# EAGLE design CC3000 (EAGLE 7.1.0)
COMPANY: ADAFRUIT INDUSTRIES; DRAWN: KTOWN; REV: C
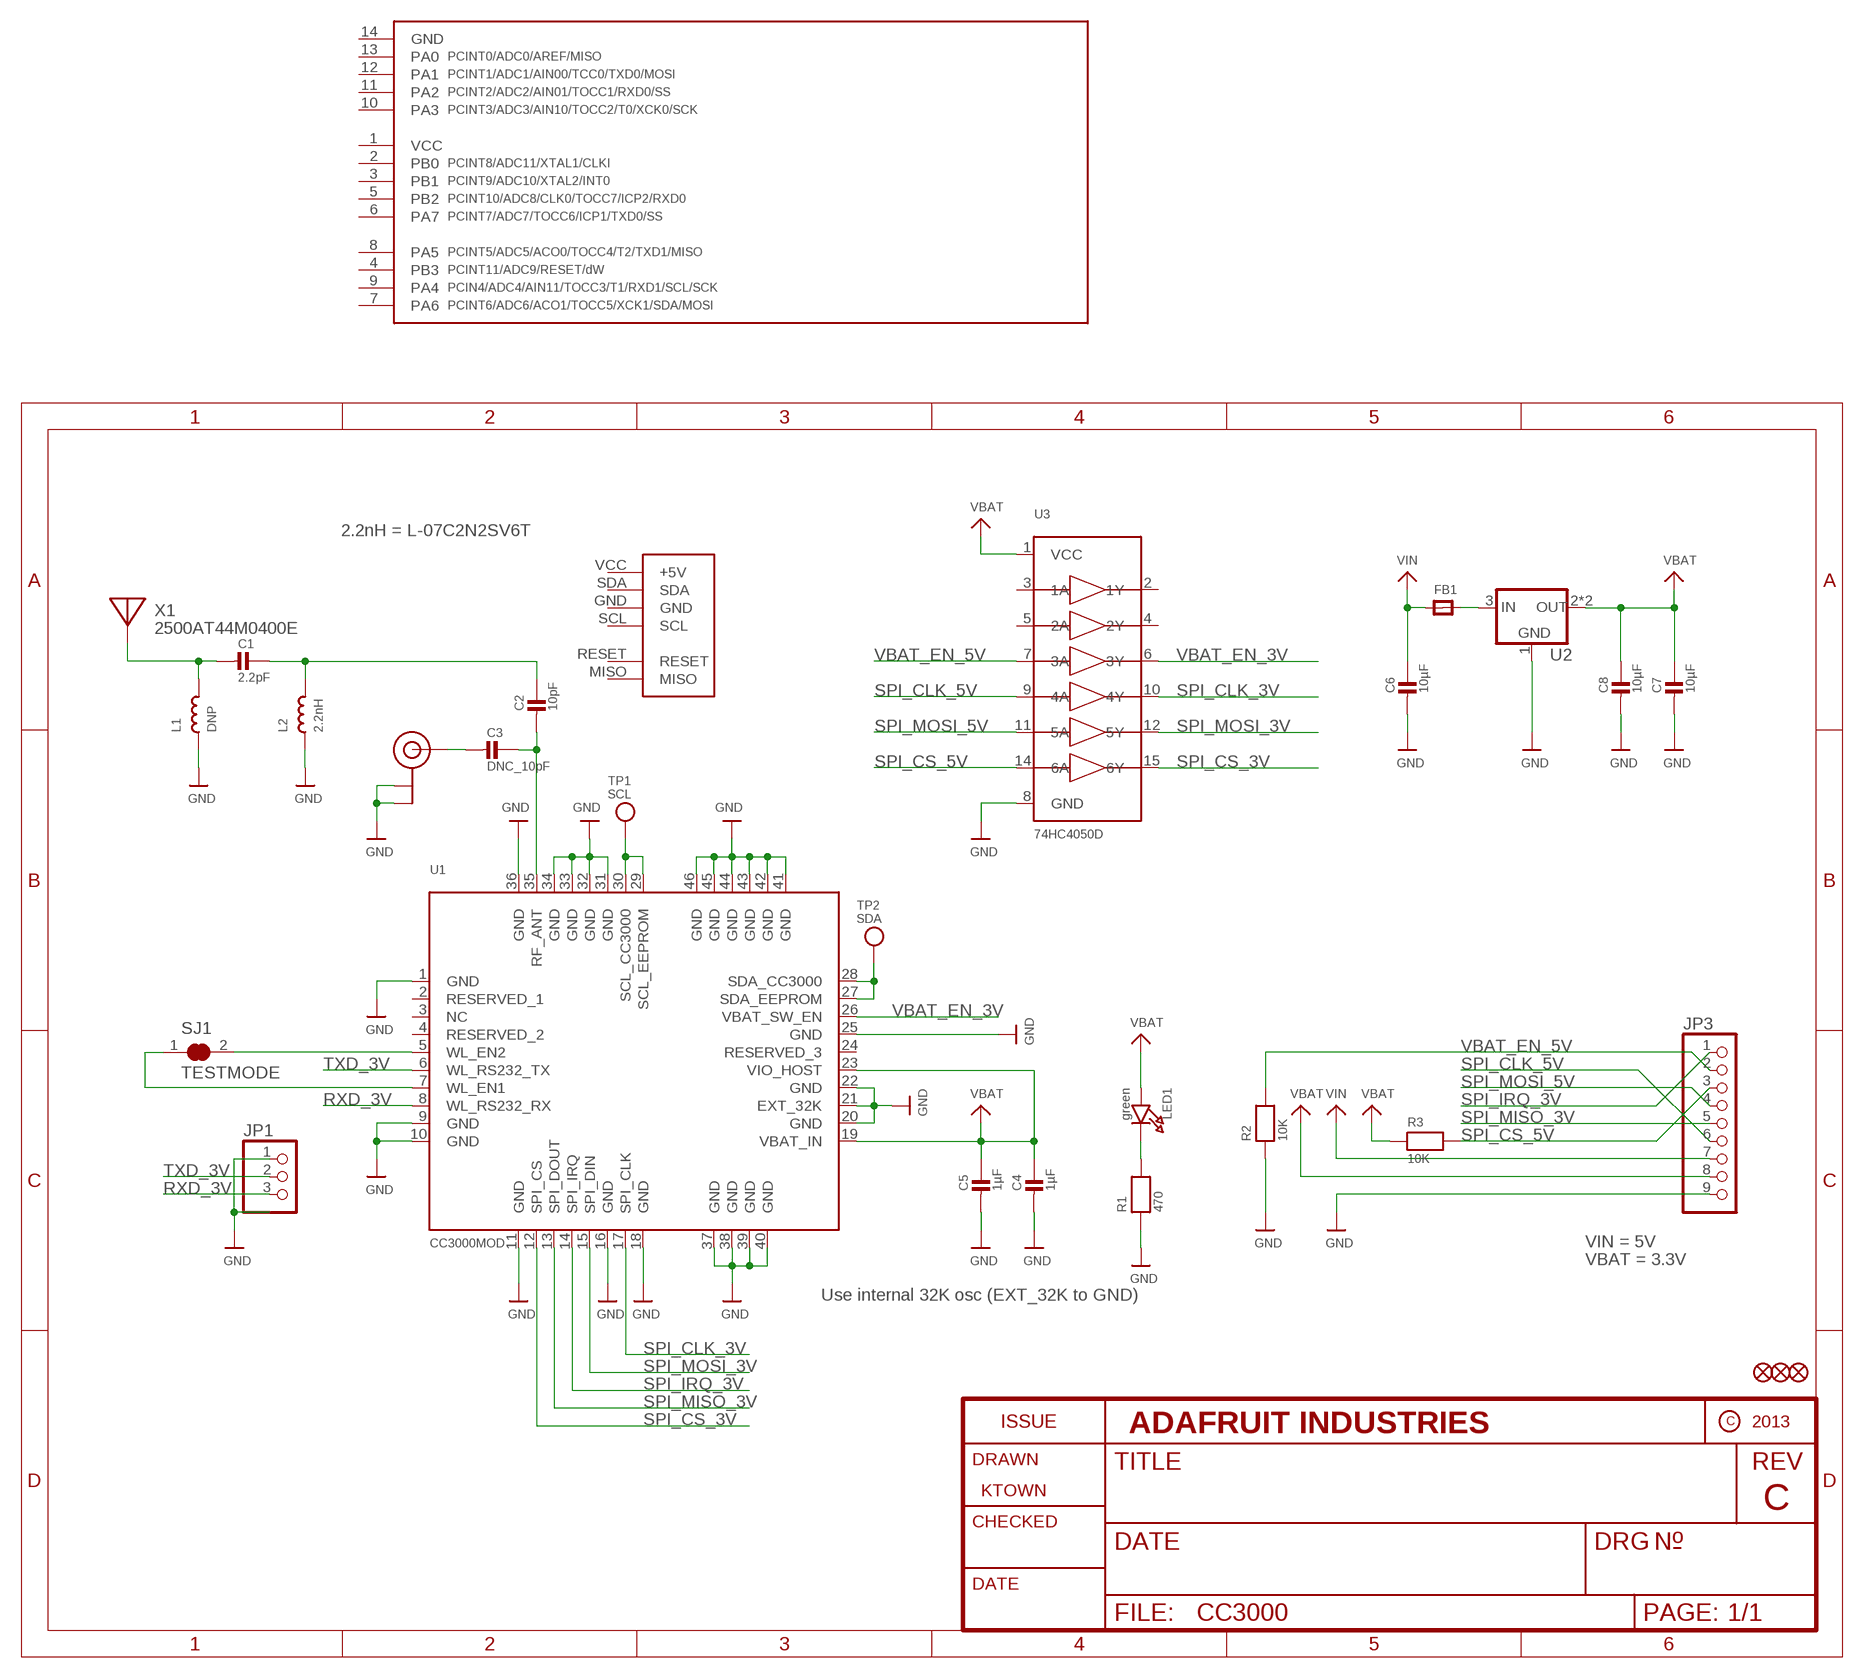
[diagram p0: schematic, sheet 1]

## Parts
C1  2.2pF  CAP_CERAMIC_0402  [_0402]
C2  10pF  CAP_CERAMIC_0402  [_0402]
C3  DNC_10pF  CAP_CERAMIC_0402  [_0402]
C4  1µF  CAP_CERAMIC_0805MP  [_0805MP]
C5  1µF  CAP_CERAMIC_0805MP  [_0805MP]
C6  10µF  CAP_CERAMIC_0805MP  [_0805MP]
C7  10µF  CAP_CERAMIC_0805MP  [_0805MP]
C8  10µF  CAP_CERAMIC_0805MP  [_0805MP]
FB1  FERRITE_0805MP  [_0805MP]
FID1  FIDUCIAL""  [FIDUCIAL_1MM]
FID2  FIDUCIAL""  [FIDUCIAL_1MM]
FID3  FIDUCIAL""  [FIDUCIAL_1MM]
JP1  HEADER-1X3ROUND  [1X03_ROUND]
JP3  HEADER-1X970MIL  [1X09_ROUND_70]
L1  DNP  INDUCTOR_0402  [_0402]
L2  2.2nH  INDUCTOR_0402  [_0402]
LED1  green  LED0805_NOOUTLINE  [CHIPLED_0805_NOOUTLINE]
R1  470  RESISTOR0805_NOOUTLINE  [0805-NO]
R2  10K  RESISTOR_0805MP  [_0805MP]
R3  10K  RESISTOR_0805MP  [_0805MP]
SJ1  TESTMODE  SOLDERJUMPER_CLOSED  [SOLDERJUMPER_CLOSEDWIRE]
TP1  SCL  TESTPOINTPAD1MM  [TESTPOINT_PAD_1MM]
TP2  SDA  TESTPOINTPAD1MM  [TESTPOINT_PAD_1MM]
U1  CC3000MOD  [CC3000MOD]
U2  VREG_SOT223  [SOT223-R]
U3  74HC4050D  [SOIC16]
U$24  TINY841  [SOIC14]
U$35  U.FL  [U.FL]
U$39  FOOTPRINTFOOTPRINT-2  [FOOTPRINT2]
X1  2500AT44M0400E  ANTENNA_JOHANSON_2500AT44M0400  [ANT_2500AT44M0400]

## Nets
GND: C4.2 C5.2 C6.2 C7.2 C8.2 JP1.1 JP3.9 L1.1 L2.1 R1.1 R2.1 U1.1(GND) U1.9(GND) U1.10(GND) U1.11(GND) U1.16(GND) U1.18(GND) U1.20(GND) U1.21(EXT_32K) U1.22(GND) U1.25(GND) U1.31(GND) U1.32(GND) U1.33(GND) U1.34(GND) U1.36(GND) U1.37(GND) U1.38(GND) U1.39(GND) U1.40(GND) U1.41(GND) U1.42(GND) U1.43(GND) U1.44(GND) U1.45(GND) U1.46(GND) U2.1(GND) U3.8(GND) U$35.P$1(GND) U$35.P$2(GND)
N$1: C1.2 L1.2 X1.FEED
N$2: C1.1 C2.1 L2.2
N$3: C3.2 U$35.P$3(SIGNAL)
N$4: C2.2 C3.1 U1.35(RF_ANT)
N$5: SJ1.2 U1.5(WL_EN2)
N$6: SJ1.1 U1.7(WL_EN1)
N$7: LED1.C R1.2
N$9: FB1.2 U2.3(IN)
RXD_3V: JP1.3 U1.8(WL_RS232_RX)
SCL_3V: TP1.P$1 U1.29(SCL_EEPROM) U1.30(SCL_CC3000)
SDA_3V: TP2.P$1 U1.27(SDA_EEPROM) U1.28(SDA_CC3000)
SPI_CLK_3V: U1.17(SPI_CLK) U3.10(4Y)
SPI_CLK_5V: JP3.6 U3.9(4A)
SPI_CS_3V: U1.12(SPI_CS) U3.15(6Y)
SPI_CS_5V: JP3.3 R3.2 U3.14(6A)
SPI_IRQ_3V: JP3.1 U1.14(SPI_IRQ)
SPI_MISO_3V: JP3.5 U1.13(SPI_DOUT)
SPI_MOSI_3V: U1.15(SPI_DIN) U3.12(5Y)
SPI_MOSI_5V: JP3.4 U3.11(5A)
TXD_3V: JP1.2 U1.6(WL_RS232_TX)
VBAT: C4.1 C5.1 C7.1 C8.1 JP3.8 LED1.A R3.1 U1.19(VBAT_IN) U1.23(VIO_HOST) U2.2(OUT) U2.4(OUT) U3.1(VCC)
VBAT_EN_3V: U1.26(VBAT_SW_EN) U3.6(3Y)
VBAT_EN_5V: JP3.2 R2.2 U3.7(3A)
VIN: C6.1 FB1.1 JP3.7
Unconnected: U1.2(RESERVED_1) U1.3(NC) U1.4(RESERVED_2) U1.24(RESERVED_3) U3.2(1Y) U3.3(1A) U3.4(2Y) U3.5(2A) U$24.1(VCC) U$24.2(PB0) U$24.3(PB1) U$24.4(PB3) U$24.5(PB2) U$24.6(PA7) U$24.7(PA6) U$24.8(PA5) U$24.9(PA4) U$24.10(PA3) U$24.11(PA2) U$24.12(PA1) U$24.13(PA0) U$24.14(GND) U$39.MISO U$39.RESET U$39.SCL U$39.SDA

## Notes on the sheet
- 2.2nH = L-07C2N2SV6T
- VIN = 5V
- VBAT = 3.3V
- Use internal 32K osc (EXT_32K to GND)

## Power pins joined to a net without a drawn wire
+5V: U$39.VCC(+5V)
GND: U$39.GND

## Library data of the parts
C1-C8 = microbuilder:CAP_CERAMIC: Ceramic Capacitors For new designs, use the packages preceded by an '_' character since they are more reliable: The following footprints should be used on most boards: _0402 - Standard footprint for regular board layouts _0603 - Standard footprint for regular board layouts _0805 - Standard footprint for regular board layouts For extremely tight-pitch boards where space is at a premium, the following 'micro-pitch' footprints can be used (smaller pads, no silkscreen outline, etc.): _0402MP - Micro-pitch footprint for very dense/compact boards _0603MP - Micro-pitch footprint for very dense/compact boards _0805MP - Micro-pitch footprint for very dense/compact boards Commonly Stocked Parts 0402 - 0402 Surface Mount Capacitors 16pF 50V 5% [Digikey: 445-4899-2-ND] 18pF 50V 5% [Digikey: 490-1281-2-ND] 22pF 50V 5% [Digikey: 490-1283-2-ND] 68pF 50V 5% [Digikey: 490-1289-2-ND] 0.1uF 10V 10% [Digikey: 490-1318-2-ND] 1.0uF 6.3V 10% [Digikey: 490-1320-2-ND] 0603 - 0603 Surface Mount Capacitors 16 pF 50V 5% [Digikey: 445-5051-2-ND] 22 pF 50V [Digikey: PCC220ACVTR-ND] 33 pF 50V 5% [Digikey: 490-1415-1-ND] 56pF 50V 5% [Digikey: 490-1421-1-ND] 220pF 50V 5% [Digikey: 445-1285-1-ND] 680 pF 50V 2200 pF 50V 5% C0G [Digikey: 445-1297-1-ND] 5600 pF 100V 5% X7R [Digikey: 478-3711-1-ND] 0.1 µF 25V 10% [Digikey: PCC2277TR-ND] 0.22 µF 16V 10% X7R [Digikey: 445-1318-1-ND] 1.0 µF 25V 10% [Digikey: 445-5146-2-ND] 0603 - RF Specific 3pF 250V +/-0.1pF RF [Digikey: 712-1347-1-ND] 18 pF 250V 5% [Digikey: 478-3505-1-ND or 712-1322-1-ND] 56 pF 250V 5% C0G RF [Digikey: 490-4867-1-ND] 68 pF 250V RF [Digikey: 490-4868-1-ND] 0805 - 0805 Surface Mount Capacitors 220 pF 250V 2% RF Ceramic Capacitor [Digikey: 712-1398-1-ND] 1000 pF 50V 2% NP0 Ceramic Capacitor [Digikey: 478-3760-1-ND] 0.1 µF 25V 10% Ceramic Capacitor [Digikey: PCC1828TR-ND] 1.0 µF 16V 10% Ceramic Capacitor[Digikey: 490-1691-2-ND] 10.0 µF 10V 10% Ceramic Capacitor[Digikey: 709-1228-1-ND] 10.0 uF 16V 10% Ceramic Capacitor [Digikey: 478-5165-2-ND] 47 uF 6.3V 20% Ceramic Capacitor [Digikey: 587-1779-1-ND or 399-5506-1-ND] 1206 - 1206 Surface Mount Capacitors 47uF 10V 20% Ceramic Capacitor [Digikey: 490-5528-1-ND or 399-5508-1-ND or 445-6010-1-ND] 100uF 6.3V -20%, +80% Y5V Ceramic Capacitor (Digikey: 490-4512-1-ND, Mouser: 81-GRM31CF50J107ZE1L)
FB1 = microbuilder:FERRITE: Ferrite Bead 0603 MMZ1608B121C - 120 Ohm @ 100MHz, 600mA, 0.15 Ohm DC Resistance - Digikey: 445-2164-1-ND BK1608HW121-T - 120 Ohm, 600mA Ferrite Chip - Digikey: 587-1876-2-ND 0805 HZ0805B272R-10 - 2.7K Ohm @ 100MHz, 200mA, 0.8 Ohm DC Resistance - Digikey: 240-2504-1-ND (see also Murata BLM21BD272SN1L) MMZ2012Y152B - 1.5K Ohm @ 100MHz, 500mA, 0.4 Ohm DC Resistance - Digikey: 445-1560-1-ND - Mainly for high frequency (80-400MHz) MMZ2012R102A - 1K Ohm @ 100MHz, 500mA, 0.3 Ohm DC Resistance - Digikey: 445-1555-2-ND - More general purpose (10-200MHz)
FID1-FID3 = microbuilder:FIDUCIAL: Fiducial Alignment Points Various fiducial points for machine vision alignment.; BOM: EXCLUDE
JP1 = microbuilder:HEADER-1X3: PIN HEADER
JP3 = microbuilder:HEADER-1X9: PIN HEADER
L1 L2 = microbuilder:INDUCTOR: Inductors 0603: 10nH Ceramic Inductor - microwire antenna/RF (Digikey: 712-1434-2-ND) 0805: 560nH Ceramic Inductor - RF (Digikey: 553-1047-1-ND) 270nH Ceramic Inductor - Q = 40@250MHz, +-5%, 1 Ohm DC Resistance (Digikey: 535-10506-2-ND) 1007 (2518 Metric) SMT: 10µH 10% 250mOhm 820mA 1007 Inductor (Digikey: 587-2189-1-ND) 22µH 10% 500mOhm 580mA 1007 Inductor (Digikey: 587-2190-1-ND) 47µH 10% 950mOhm 420mA 1007 Inductor (Digikey: 587-2191-1-ND) 47µH 5% 100mOhm 1A 1008 Inductor (Digikey: 732-1816-1-ND) 5.0x5.0mm (Taiyo Yuden NR5040 Series) 6.8µH 20% 2.3A 64mOhm Inductor (Digikey: 587-2374-2-ND) 5.0x5.0mm (TDK VLC5045 Series) 4.7µH 20% 3.3A 34mOhm Inductor (Digikey: 445-6526-1-ND) 6.8µH 20% 2.7A 46mOhm Inductor (Digikey: 445-6527-1-ND) 6.0x6.0mm (TDK VLC6045 Series) 4.7µH 20% 3.8A 27mOhm Inductor (Digikey: 445-6538-2-ND) 6.8µH 20% 3A 41mOhm Inductor (Digikey: 445-6540-1-ND) 6.2µH 30% 2.2A 45mOhm Inductor (Digikey: SRR5028-6R2YCT-ND) - Not TDK VLC6045 but footprint should match 6.0x6.0mm (TDK SLF6045 Series) 6.8uH 30% 2A 33mOhm Inductor (Digikey: 445-4572-1-ND, Mouser: 810-SLF645T6R8N2R0PF) 6.0x6.0mm (Sumida CDRH5D28 Series) 6.2uH 30% 1.8A 45mOhm Inductor (Digikey: 308-1542-1-ND) Taiyo Yuden NR3015T2R2M - 2.2uH 20% 1.5A (Digikey: 587-1648-2-ND, Mouser: 963-NR3015T2R2M) - Used with TI TPS62172 CoilCraft RFID Transponder Coil - MA5532-AE (For use with AS3935 Lightning Sensor)
LED1 = microbuilder:LED: LED 0603 - 0603 Surface Mount Package 2mA: Green LED - Low Power (3.9mcd, 2ma, 1.7Vf) - Digikey: 475-2709-2-ND Orange LED - Low Power (9.8mcd, 2ma, 1.8Vf) - Digikey: 475-1194-2-ND Red LED - Low Power (5mcd, 2ma, 1.8Vf) - Digikey: 475-1195-2-ND Yellow LED - Low Power (7mcd, 2ma, 1.8Vf) - Digikey: 475-1196-2-ND 5mA: Blue LED - Low Power (17mcd, 5ma, 2.9Vf) - Digikey: LNJ937W8CRACT-ND 0805 - 0805 Surface Mount Package 2mA: Red LED (8.8mcd, 2mA, 1.8Vf, Clear) - Low Power [Digikey: 475-2510-1-ND] Green LED (5mcd, 2mA, 1.8Vf, Clear) - Low Power [Digikey: 475-2730-1-ND] Yellow LED (11.3mcd, 2mA, 1.8Vf, Clear) - Low Power [Digikey: 475-2555-1-ND] 20mA: Red LED (104mcd, 20mA, Diffused) - LS R976 [Digikey: 475-1278-6-ND] Red LED (12mcd, 20mA, 2.0Vf, Clear) - APT2012EC [Digikey: 754-1128-1-ND] Green LED (15mcd, 20mA, 2.2Vf, Clear) - APT2012GC [Digikey: 754-1131-1-ND] Orange LED (160mcd, 20mA, 2.1Vf, Clear) - APT2012SECK [Digikey: 754-1130-1-ND] 1206 - 1206 Surface Mount Package Green LED (26mcd, 20mA, Diffused) - LG N971 [Digikey: 475-1407-6-ND] Red LED (15mcd, 20mA, Diffused) - LH N974 [Digikey: 475-1416-6-ND] Cree - Cree High-Power Surface Mount LEDs XPEBWT-L1-0000-00D50 - White 111lm 350mA 2.9Vf 6200K 110° XTEAWT-00-0000-00000LEE3 - White 114lm 350mA 2.85Vf 5000K 115° Everlight - Everlight 45-21 Series Surface Mount LEDs 45-21/QK2C-B2832AC2CB2/2T - Warm White 2000mcd 20mA 3.25Vf 3050K 120° 45-21/LK2C-B38452C4CB2/2T - Nuetral White 2000mcd 20mA 3.25Vf 4150K 120° 45-21/LK2C-B50634C6CB2/2T - Cold White 2200mcd 20mA 3.25Vf 5650K 120° PLCC2 Reverse Mount LS T77K-J1L2-1-0-2-R18-Z - Red 11.25mcd 2mA 1.8Vf 630nm 120° LO T77K-L1M2-24-Z - Orange 19.6mcd 2mA 1.8Vf 606nm 120° LY T77K-K2M1-26-Z - Yellow 15.7mcd 2mA 1.8Vf 587nm 120°
R1-R3 = microbuilder:RESISTOR: Resistors For new designs, use the packages preceded by an '_' character since they are more reliable: The following footprints should be used on most boards: _0402 - Standard footprint for regular board layouts _0603 - Standard footprint for regular board layouts _0805 - Standard footprint for regular board layouts For extremely tight-pitch boards where space is at a premium, the following 'micro-pitch' footprints can be used (smaller pads, no silkscreen outline, etc.): _0402MP - Micro-pitch footprint for very dense/compact boards _0603MP - Micro-pitch footprint for very dense/compact boards _0805MP - Micro-pitch footprint for very dense/compact boards
SJ1 = microbuilder:SOLDERJUMPER_CLOSED: Solder Jumper - Closed These solder jumpers are closed by default CLOSEDWIRE - 10 mil trace between pads that can be cut and resoldered later CLOSEDPERM - 63 mil trace between pads for a permanent connection (used to 'bridge' two signals, a shameless hack for Eagle). Can double as a test point as well (no cream layer)
TP1 TP2 = microbuilder:TESTPOINT: Test Point Various test points for characterisation and PCB testing TESTPOINT_SMT - Compact Surface Mount Test Point [Digikey: 5016KTR-ND]
U1 = microbuilder:CC3000MOD: CC3000MOD Wifi Module
U2 = microbuilder:VREG_SOT223: SOT-223 Fixed Voltage Regulators Part Current Out V Out V In V Dropout θJA (°C/W) TJ (°C) Operating Temp Digikey Part No. AP1117 1A 3.3V 18V 1.1V@500mA, 1.3V@1A 107°C/W 150°C -40°C-125°C AP1117IE33G-13DICT-ND Max operating temp can be calculated using θJA, TJ (max junction temperature), and power in watts. Set the "Maximum Ambient Temperature" until it reaches TJ ("Max Junction Temperature"), which is the absolute limit for safe use of the regulator: Heat Sink Temperature Calculator <http://www.daycounter.com/Calculators/Heat-Sink-Temperature-Calculator.phtml> For example, With 12V source into a 3.3V LP2985 and a 30mA load, we are dissipating (12V-3.3V) * 0.03A = 0.261W. With a θJA of 206 °C/W, a TJ of 150°C, and 261mW we can safely use the chip without a heat sink up to 75°C (=147.1°C Junction Temperature).
U3 = microbuilder:74HC4050D: 6-channel level shifter 74HC4050D - 2V-6V Supply SOIC16 Digikey: 74HC4050D,653-ND Mouser: 771-74HC4050D-T TSSOP16 Digikey: 296-9215-1-ND Mouser:
U$24 = IntegerLabs:TINY841
U$35 = microbuilder:U.FL: U.FL Antenna Connector
U$39 = IntegerLabs:FOOTPRINT
X1 = microbuilder:ANTENNA_JOHANSON_2500AT44M0400: Johanson 2.3-2.7 GHz Chip Antenna Frequency Range: 2400 - 2500 Mhz Peak Gain 2.5 dBi typ. (XZ-V) Average Gain 0.5 dBi typ. (XZ-V) Input Power 3W max. Operating Temperature -40 to +85°C Digikey: 712-1403-1-ND Mouser: 609-2500AT44M0400E

## Board
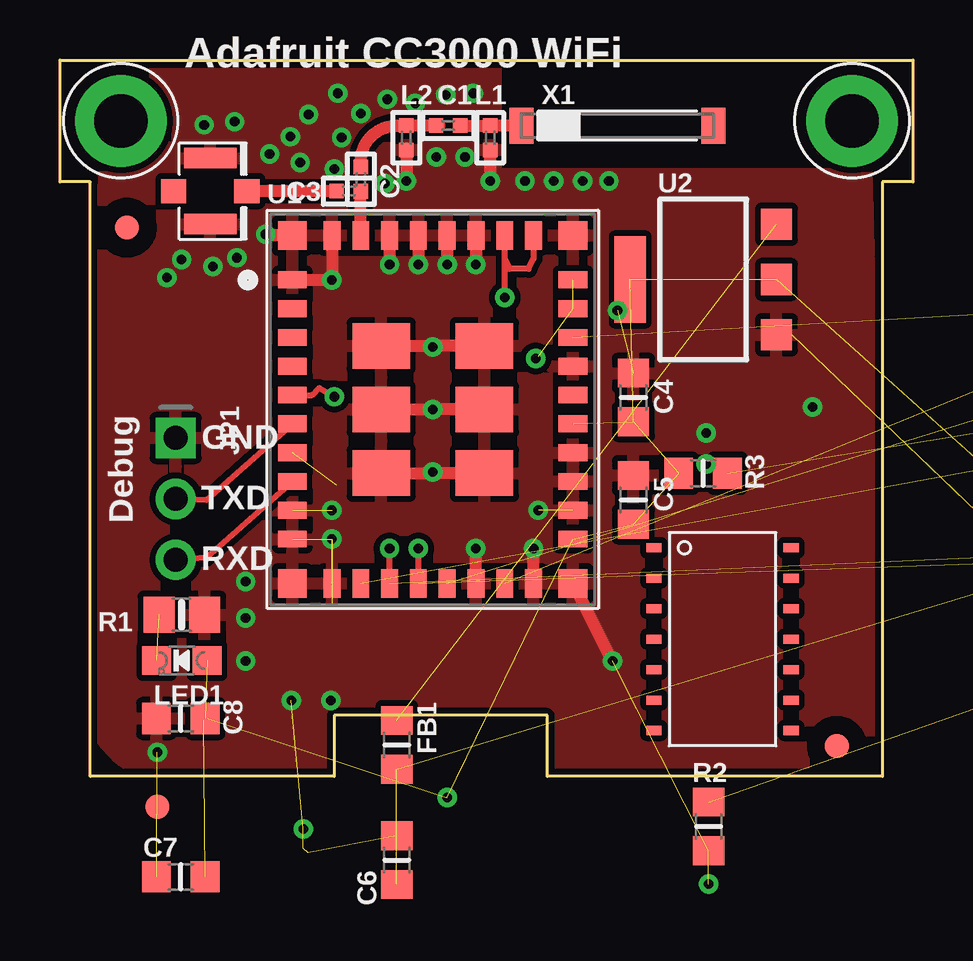
[diagram p1: board, top side]
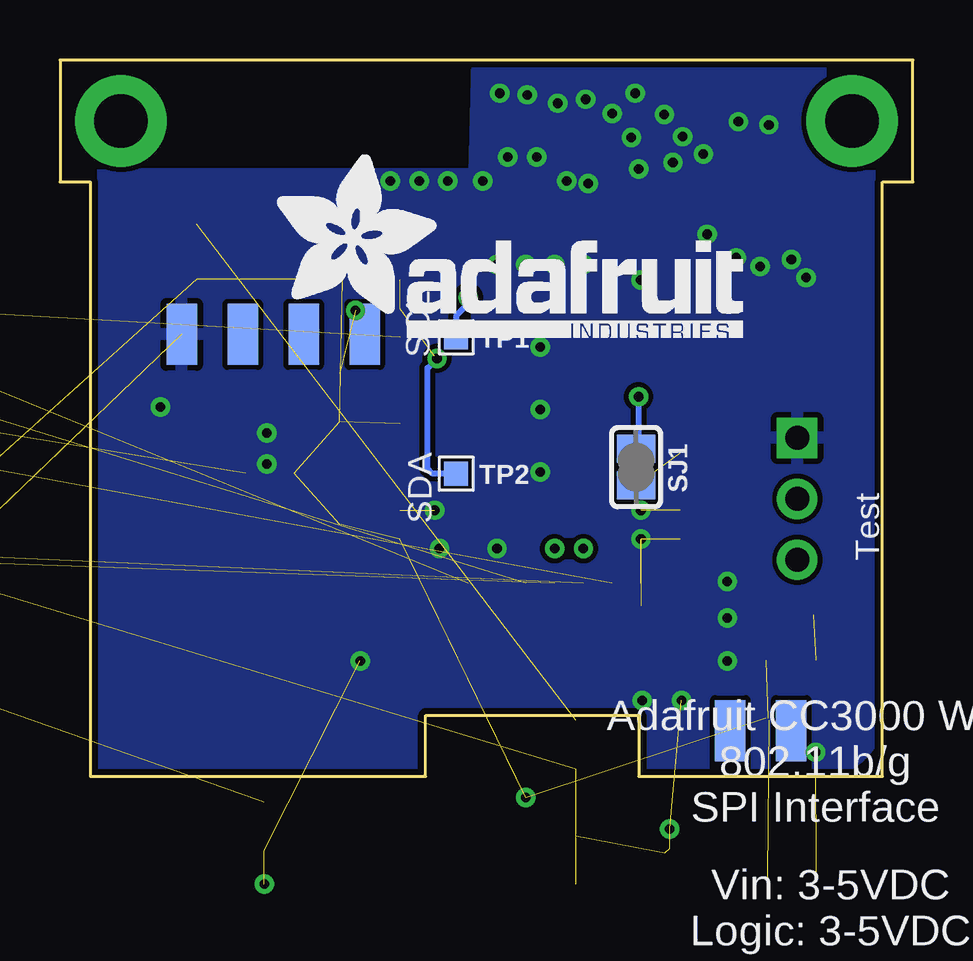
[diagram p2: board, bottom side, seen from below]

Size 35.56 x 29.84 mm. Coordinates in mm from the lower left corner, seen from the top.
Copper layers (1*16): Top 0.035mm / dielectric 1.5mm / Bottom 0.035mm
Design rules "adafruit": minimum track width 8mil, minimum drill 15.5mil, track to track 8mil, track to pad 8mil, pad to pad 8mil, via to via 8mil, smd to smd 8mil, copper to edge 10mil, drill to drill 8mil, minimum pad ring 10mil, minimum via ring 8mil, stop-mask expansion 4mil, vias tented up to drill 20mil, thermal gap 10mil

### Footprints (pad centres in the part's own frame; a part is rotated, then mirrored left to right if it is on the bottom)
_0402 = smd 0.6 x 0.6: 1 -0.508,0; 2 0.508,0
_0805MP = smd 1.2 x 1.3: 1 -1.016,0; 2 1.016,0
FIDUCIAL_1MM = smd 1 x 1: 1 0,0
1X03_ROUND = drill 1 pad 1.676 square: 1 -2.54,0 | drill 1 pad 1.676: 2 0,0; 3 2.54,0
1X09_ROUND_70 = drill 1 pad 1.778 octagon: 1 -10.16,0 | drill 1 pad 1.778: 2 -7.62,0; 3 -5.08,0; 4 -2.54,0; 5 0,0; 6 2.54,0; 7 5.08,0; 8 7.62,0; 9 10.16,0
CHIPLED_0805_NOOUTLINE = smd 1.2 x 1.2: A 0,-1.05; C 0,1.05
0805-NO = smd 1.3 x 1.5: 1 -0.95,0; 2 0.95,0
SOLDERJUMPER_CLOSEDWIRE = smd 1.168 x 1.6: 1 -0.762,0; 2 0.762,0 | smd 0.635 x 0.203: WIRE 0,0
TESTPOINT_PAD_1MM = smd 1 x 1: P$1 0,0
CC3000MOD = smd 1.2 x 0.7: 1 -5.85,5.4; 2 -5.85,4.2; 3 -5.85,3; 4 -5.85,1.8; 5 -5.85,0.6; 6 -5.85,-0.6; 7 -5.85,-1.8; 8 -5.85,-3; 9 -5.85,-4.2; 10 -5.85,-5.4; 19 5.85,-5.4; 20 5.85,-4.2; 21 5.85,-3; 22 5.85,-1.8; 23 5.85,-0.6; 24 5.85,0.6; 25 5.85,1.8; 26 5.85,3; 27 5.85,4.2; 28 5.85,5.4 | smd 0.7 x 1.2: 11 -4.2,-7.25; 12 -3,-7.25; 13 -1.8,-7.25; 14 -0.6,-7.25; 15 0.6,-7.25; 16 1.8,-7.25; 17 3,-7.25; 18 4.2,-7.25; 29 4.2,7.25; 30 3,7.25; 31 1.8,7.25; 32 0.6,7.25; 33 -0.6,7.25; 34 -1.8,7.25; 35 -3,7.25; 36 -4.2,7.25 | smd 2.4 x 1.9: 37 -2.15,2.65; 38 -2.15,0; 39 -2.15,-2.65; 40 2.15,2.65; 41 2.15,0; 42 2.15,-2.65 | smd 1.2 x 1.2: 43 -5.85,7.25; 44 -5.85,-7.25; 45 5.85,-7.25; 46 5.85,7.25
SOT223-R = smd 1.3 x 1.3: 1 -2.3,-3.05; 2 0,-3.05; 3 2.3,-3.05 | smd 3.6 x 1.3: 4 0,3.05
SOIC16 = smd 0.6 x 2.2: 1 -4.445,-2.6; 2 -3.175,-2.6; 3 -1.905,-2.6; 4 -0.635,-2.6; 5 0.635,-2.6; 6 1.905,-2.6; 7 3.175,-2.6; 8 4.445,-2.6; 9 4.445,2.6; 10 3.175,2.6; 11 1.905,2.6; 12 0.635,2.6; 13 -0.635,2.6; 14 -1.905,2.6; 15 -3.175,2.6; 16 -4.445,2.6
SOIC14 = smd 0.381 x 0.635: 1 0,-3.175; 2 1.27,-3.175; 3 2.54,-3.175; 4 3.81,-3.175; 5 5.08,-3.175; 6 6.35,-3.175; 7 7.62,-3.175; 8 7.62,2.54; 9 6.35,2.54; 10 5.08,2.54; 11 3.81,2.54; 12 2.54,2.54; 13 1.27,2.54; 14 0,2.54
U.FL = smd 2.2 x 0.85: P$1 0,1.375; P$2 0,-1.375 | smd 1.05 x 1: P$3 1.525,0; P$4 -1.525,0
FOOTPRINT2 = smd 1.27 x 2.54 bottom: GND 5.08,11.43; MISO 30.48,27.94; RESET 27.94,27.94; SCL 12.7,11.43; SDA 7.62,11.43; VCC 10.16,11.43 | drill 2.223 pad 3.81: P$1 2.54,2.54; P$2 33.02,2.54
ANT_2500AT44M0400 = smd 1 x 1.5: FEED 4,0; NC -4,0

### Placement (x,y rotation side)
C1  16.19,27.11 0 top
C2  12.54,24.88 270 top
C3  12.04,24.38 180 top
C4  23.91,15.78 90 top
C5  23.91,11.52 90 top
C6  14.04,-3.49 90 top
C7  5.04,-4.19 180 top  (outside the outline)
C8  5.04,2.41 180 top
FB1  14.04,1.31 90 top
FID1  32.38,1.27 0 top
FID2  4.06,-1.27 0 top
FID3  2.79,22.86 0 top
JP1  4.83,11.56 270 top
JP3  49.83,9.62 180 top  (outside the outline)
L1  17.93,26.61 90 top
L2  14.44,26.61 90 top
LED1  5.08,4.83 90 top
R1  5.08,6.73 180 top
R2  27.04,-2.09 90 top
R3  26.81,12.63 0 top
SJ1  11.54,12.88 90 bottom
TP1  19.04,18.28 0 bottom
TP2  19.04,12.61 0 bottom
U1  15.54,15.28 0 top
U2  26.82,20.7 90 top
U3  54.23,18.41 90 top  (outside the outline)
U$24  27.94,9.52 270 top
U$35  6.27,24.38 0 top
U$36  [ADAFRUIT_TEXT_20MM]  26.67,18.29 0 bottom
U$39  35.56,29.84 180 top
X1  23.23,27.11 180 top

### Tracks (layer width: path | path; a pad name or v marks a point on that pad's centre or on a via)
GND  (via drill 0.4)  (15 unrouted)
  Top 0.5: U1.37 15.49,17.93 v15.54,17.88 15.59,17.93 U1.40 | U1.38 v15.54,15.28 U1.41 | U1.39 15.49,12.63 v15.54,12.68 15.59,12.63 U1.42 | U1.16 v17.34,9.48 | U1.18 v19.74,9.48 | U1.45 22.99,4.86 v23.04,4.81 | 4.04,-4.21 C7.2 | U1.1 v11.34,20.68 U1.36 | U1.34 v13.74,21.32 | U1.33 v14.94,21.32 | U1.32 v16.14,21.32 | U1.31 v17.34,21.32 | U1.43 8.62,22.53 v8.57,22.58 | L2.1 v14.44,24.81 | L1.1 v17.93,24.81
  other vias: 11.34,9.88 11.34,11.08 31.37,15.39 19.94,11.08 27.04,-4.49 10.14,-2.19 7.74,4.81 16.08,28.39 4.46,20.77 9.61,26.65 10.01,25.58 17.22,28.46 11.58,28.46 6.37,21.24 11.44,25.31 11.74,26.61 12.54,27.61 13.64,28.21 15.69,25.81 16.89,25.81 7.28,27.27 6.01,27.14 8.74,25.93 7.38,21.6 5.07,21.53 23.24,19.41 26.94,14.31 26.94,13.01 19.39,24.81 20.59,24.81 21.79,24.81 22.89,24.81 13.54,24.7 14.81,28.04 10.36,27.58 4.06,1 7.74,6.59 7.74,8.11 9.64,3.16 11.3,3.16
  pour Bottom: 4.27,0 33.8,0 arc90 34.26,0.46 34.26,25.11 18.29,25.11 18.16,29.84 5.54,29.84 arc90 1.27,26.84 1.27,3 arc90
  pour Top (isolate 0.254): 18.16,29.84 18.16,25.11 33.62,25.11 34.26,1.09 arc-90 32.52,0 4.27,0 arc-90 1.27,3.63 1.27,28.74 arc-90 3.63,29.84
N$1
  Top 0.508: C1.2 18.02,27.11 | L1.2 X1.FEED
  Top 0.584: 18.02,27.11 arc90 L1.2
N$2
  Top 0.508: C2.1 12.54,25.61 arc-90 14.04,27.11 14.53,27.11 | L2.2 15.77,27.12
  Top 0.584: 14.53,27.11 arc90 L2.2 | 15.77,27.12 arc-90 C1.1
N$3
  Top 0.508: C3.2 9.07,24.38 U$35.P$3
N$4
  Top 0.508: U1.35 C2.2 C3.1
N$5  (via drill 0.4)
  Top 0.25: U1.5 10.5,15.88 10.8,16.18 v11.44,15.81
  Bottom 0.25: v11.44,15.81 11.44,13.74 SJ1.2
N$6  (1 unrouted)
N$7  (1 unrouted)
  Top 0.406: 4.06,4.7 LED1.C 4.06,4.83
N$9  (1 unrouted)
RXD_3V
  Top 0.254: U1.8 6.1,9.11 JP1.3
SCL_3V  (via drill 0.4)
  Top 0.25: U1.29 19.74,21.58 19.54,21.14 18.74,21.14 18.54,21.58 | U1.30 18.54,21.58 | 18.54,21.58 v18.54,19.95
  Bottom 0.25: v18.54,19.95 18.54,19.68 19.04,19.18 TP1.P$1
SDA_3V  (via drill 0.4)  (2 unrouted)
  Top 0.25: 19.94,17.51 v19.84,17.41
  Bottom 0.25: TP2.P$1 20.04,12.61 20.24,12.81 20.24,17.01 v19.84,17.41
SPI_CLK_3V  (1 unrouted)
SPI_CLK_5V  (1 unrouted)
SPI_CS_3V  (1 unrouted)
SPI_CS_5V  (2 unrouted)
SPI_IRQ_3V  (via drill 0.4)  (1 unrouted)
  Top 0.25: U1.14 v14.94,9.48
SPI_MISO_3V  (via drill 0.4)  (1 unrouted)
  Top 0.25: U1.13 v13.74,9.48
SPI_MOSI_3V  (1 unrouted)
SPI_MOSI_5V  (1 unrouted)
TXD_3V
  Top 0.254: U1.6 6.1,11.51 JP1.2
VBAT  (via drill 0.4)  (12 unrouted)
  Top 0.406: C8.1 6.13,2.41
  Top 0.5: 5.99,-4.32 C7.1 | 5.99,2.34 C8.1
  other vias: 16.14,-0.89
VBAT_EN_3V  (1 unrouted)
VBAT_EN_5V  (2 unrouted)
VIN  (2 unrouted)
  Top 0.5: 13.86,-4.69 C6.1

### Text on the board
tPlace: Adafruit CC3000 WiFi | GND | Debug | TXD | RXD
bPlace: Test | Adafruit CC3000 WiFi / 802.11b/g / SPI Interface | Vin: 3-5VDC / Logic: 3-5VDC